# EAGLE design mb_01-1 (EAGLE 7.7.0)
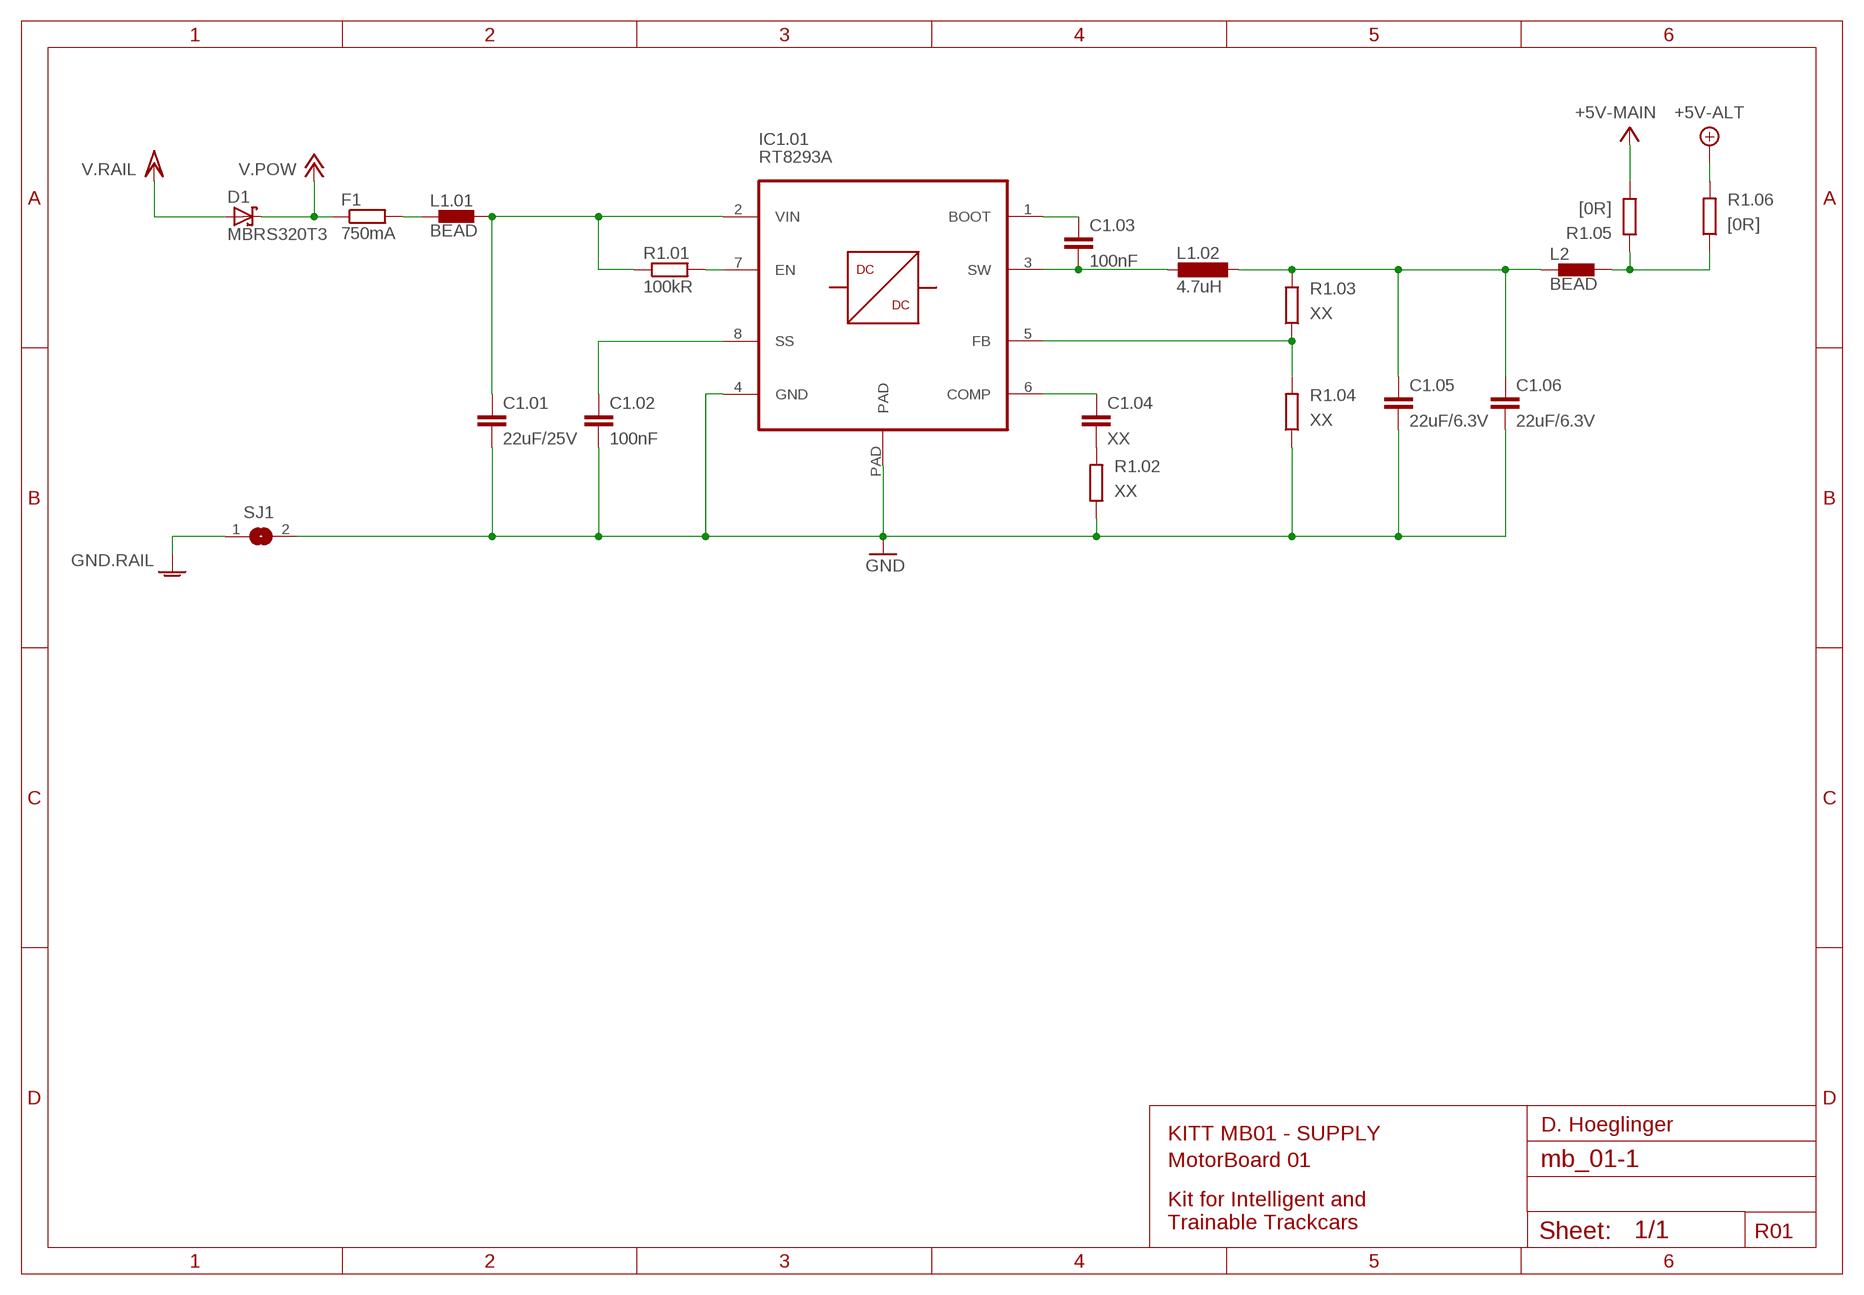
[diagram p0: schematic, sheet 1]

## Parts
C1.01  22uF/25V  C-EUC1210K  [C1210K]
C1.02  100nF  C-EUC0402K  [C0402K]
C1.03  100nF  C-EUC0402K  [C0402K]
C1.04  XX  C-EUC0402K  [C0402K]
C1.05  22uF/6.3V  C-EUC1206K  [C1206K]
C1.06  22uF/6.3V  C-EUC1206K  [C1206K]
D1  MBRS320T3  [SMC]
F1  750mA  R-EU_R0805  [R0805]
IC1.01  RT8293A  [SOIC-8-PAD]
L1.01  BEAD  BLM15HB121SN1  [0402]
L1.02  4.7uH  NRS8030XX  [TAIYO-YUDEN.NRS8030T4R7MJGJ]
L2  BEAD  BLM15HB121SN1  [0402]
R1.01  100kR  R-EU_R0402  [R0402]
R1.02  XX  R-EU_R0402  [R0402]
R1.03  XX  R-EU_R0402  [R0402]
R1.04  XX  R-EU_R0402  [R0402]
R1.05  [0R]  R-EU_R0402  [R0402]
R1.06  [0R]  R-EU_R0402  [R0402]
SJ1  SJ  [SJ]

## Nets
+5V: R1.05.1 R1.06.2 ; supply symbol labelled +5V-MAIN, +5V-ALT
+12V: D1.C F1.1 ; supply symbol labelled V.POW
GND: C1.01.2 C1.02.2 C1.05.2 C1.06.2 IC1.01.4(GND) IC1.01.PAD R1.02.1 R1.04.1 SJ1.2
GNDA: SJ1.1 ; supply symbol labelled GND.RAIL
N$2: F1.2 L1.01.1
N$3: C1.01.1 IC1.01.2(VIN) L1.01.2 R1.01.1
N$4: IC1.01.7(EN) R1.01.2
N$5: C1.02.1 IC1.01.8(SS)
N$7: C1.04.2 R1.02.2
N$25: C1.04.1 IC1.01.6(COMP)
N$28: IC1.01.5(FB) R1.03.1 R1.04.2
N$29: C1.05.1 C1.06.1 L1.02.1 L2.1 R1.03.2
N$30: C1.03.2 IC1.01.3(SW) L1.02.2
N$31: C1.03.1 IC1.01.1(BOOT)
N$32: L2.2 R1.05.2 R1.06.1
VCC/2: D1.A ; supply symbol labelled V.RAIL

## Notes on the sheet
- D. Hoeglinger
- KITT MB01 | - SUPPLY
- MotorBoard 01
- Kit for Intelligent and
  Trainable Trackcars
- R01

## Library data of the parts
C1.01-C1.06 = rcl:C-EU: CAPACITOR, European symbol
D1 = diode:MBRS3*0T3: SCHOTTKY BARRIER RECTIFIER 3.0 AMPERES 20, 30, 40 VOLT Source: MBRS340T3-D.pdf
F1 R1.01-R1.06 = rcl:R-EU_: RESISTOR, European symbol
IC1.01 = kitt.ic:RT8293A
L1.01 L2 = inductors:BLM15H: EMIFIL (R) Chip Ferrite Bead for GHz Noise Source: http://www.murata.com/ Ferrite Bead BLM15H.pdf
L1.02 = kitt.psvs:NRS8030XX
SJ1 = jumper:SJ: SMD solder JUMPER

## Board
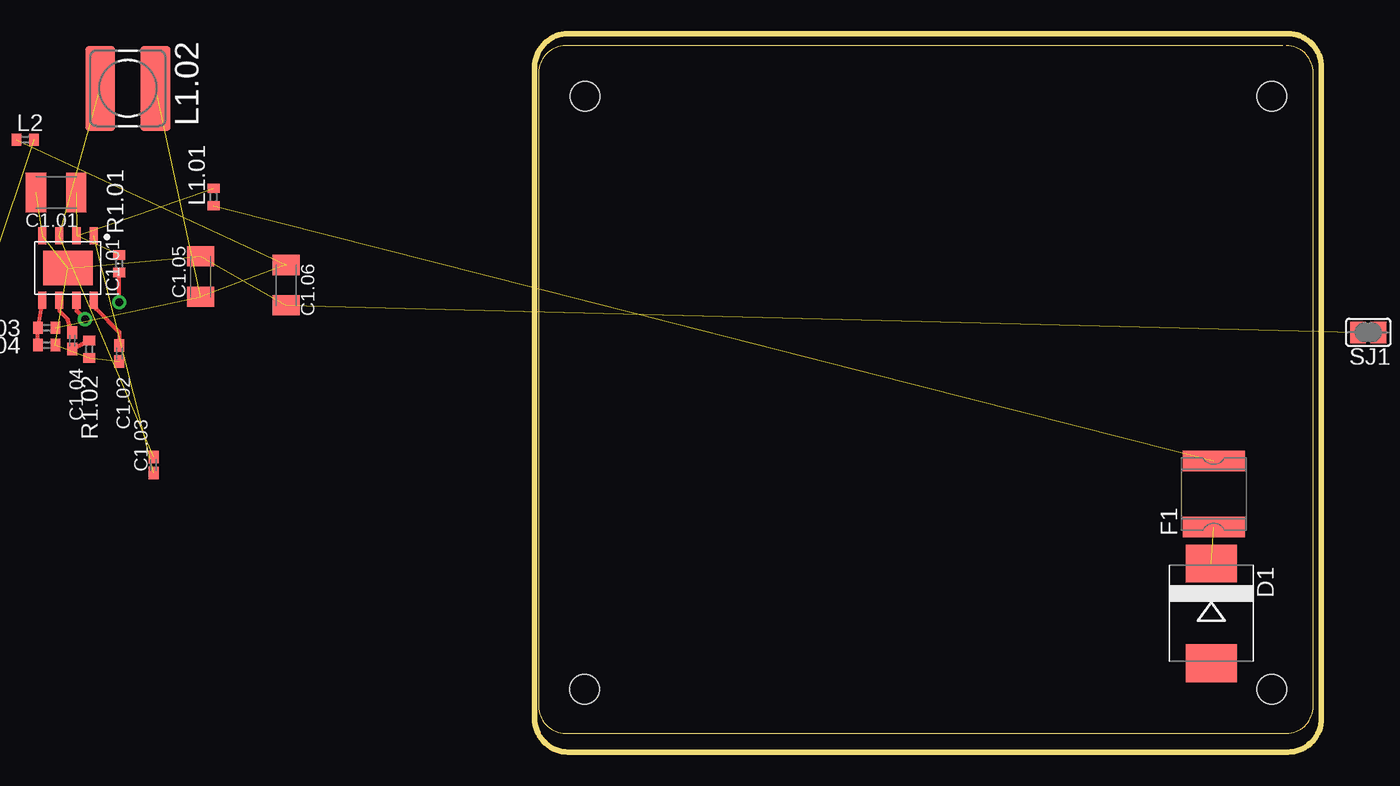
[diagram p1: board, top side]
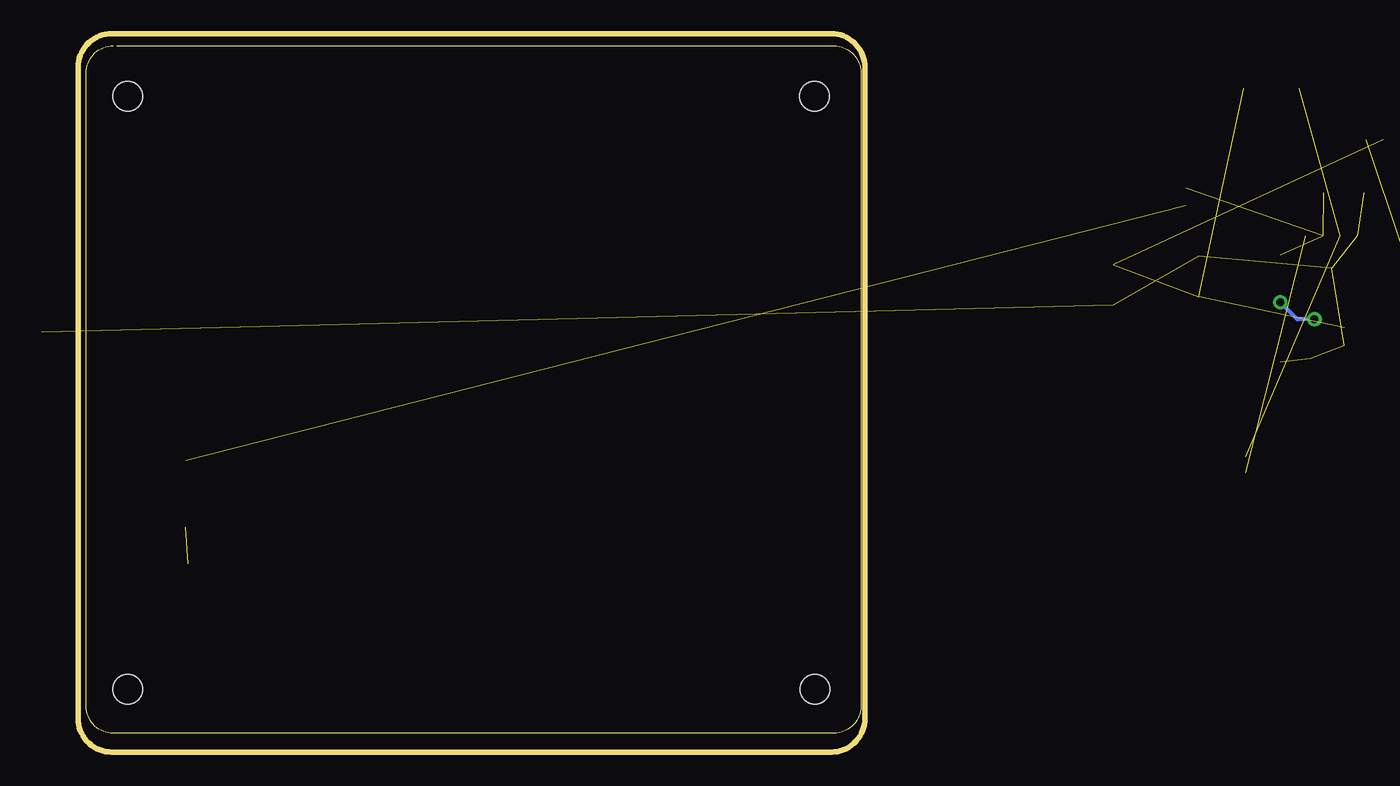
[diagram p2: board, bottom side, seen from below]

Size 58.4 x 53.3 mm. Coordinates in mm from the lower left corner, seen from the top.
Outline: 55.55,52.4 2.3,52.4 arc90 0.3,50.4 0.3,3.4 arc90 2.3,1.4 55.8,1.4 arc90 57.8,3.4 57.8,50.4 arc90 55.8,52.4
Outline: 2.5,53.3 arc90 0,50.8 0,2.5 arc90 2.5,0 55.9,0 arc90 58.4,2.5 58.4,50.8 arc90 55.9,53.3 2.4,53.3
Copper layers (1*2+3*4+5*6+7*16): Top 0.035mm / dielectric 0.2mm / Route2 0.035mm / dielectric 0.15mm / Route3 0.035mm / dielectric 0.2mm / layer 4 0.035mm / dielectric 0.15mm / layer 5 0.035mm / dielectric 0.2mm / layer 6 0.035mm / dielectric 0.15mm / layer 7 0.035mm / dielectric 0.2mm / Bottom 0.035mm
Design rules "default *": minimum track width 6mil, minimum drill 0.25mm, track to track 6mil, track to pad 8mil, pad to pad 8mil, via to via 6mil, smd to smd 8mil, copper to edge 12mil, drill to drill 24mil, minimum pad ring 9mil, minimum via ring 9mil, stop-mask expansion 3mil, vias tented up to drill 0mil, thermal gap 12mil
Holes 2.2 mm at 3.72,4.65 54.72,4.65 3.74,48.64 54.72,48.64
Milling: 4 lines

### Footprints (pad centres in the part's own frame; a part is rotated, then mirrored left to right if it is on the bottom)
C1210K = smd 1.5 x 2.9: 1 -1.5,0; 2 1.5,0
C0402K = smd 0.925 x 0.74: 1 -0.6,0; 2 0.6,0
C1206K = smd 1.5 x 2: 1 -1.5,0; 2 1.5,0
SMC = smd 2.8 x 3.8: A 3.7,0; C -3.7,0
MF-SMDF050 = smd 1.5 x 4.6: 1 -2.45,0; 2 2.45,0
SOIC-8-PAD = smd 1.27 x 0.6: 1 -2.4,1.905; 2 -2.4,0.635; 3 -2.4,-0.635; 4 -2.4,-1.905; 5 2.4,-1.905; 6 2.4,-0.635; 7 2.4,0.635; 8 2.4,1.905 | smd 2.55 x 3.7: PAD 0,0
0402 = smd 0.7 x 0.9: 1 -0.65,0; 2 0.65,0
POWER-CHOKE_WE-TPC = smd 6.3 x 2.2: 1 0,2.05; 2 0,-2.05
R0402 = smd 0.7 x 0.9: 1 -0.65,0; 2 0.65,0
SJ = smd 1.168 x 1.6: 1 -0.762,0; 2 0.762,0

### Placement (x,y rotation side)
C1.01  -35.51,41.52 180 top  (outside the outline)
C1.02  -30.82,29.57 270 top  (outside the outline)
C1.03  -28.28,21.31 90 top  (outside the outline)
C1.04  -34.32,30.52 270 top  (outside the outline)
C1.05  -24.79,35.28 90 top  (outside the outline)
C1.06  -18.44,34.64 270 top  (outside the outline)
D1  50.23,10.29 270 top
F1  750mA  [MF-SMDF050]  50.4,19.15 90 top
IC1.01  -34.63,35.91 270 top  (outside the outline)
L1.01  -23.82,41.19 90 top  (outside the outline)
L1.02  4.7uH  [POWER-CHOKE_WE-TPC]  -30.19,49.25 270 top  (outside the outline)
L2  -37.81,45.44 0 top  (outside the outline)
R1.01  -30.82,36.23 270 top  (outside the outline)
R1.02  -33.05,29.88 90 top  (outside the outline)
R1.03  -36.22,31.47 0 top  (outside the outline)
R1.04  -36.22,30.2 180 top  (outside the outline)
R1.05  -101.31,-144.11 0 top  (outside the outline)
R1.06  -101.31,-149.19 0 top  (outside the outline)
SJ1  61.87,31.14 180 top
U$1  [REF_GCB2_BS]  -158.78,7.02 0 top  (outside the outline)
U$2  [REF_GCB2_TS]  -57.81,3.69 0 top  (outside the outline)

### Tracks (layer width: path | path; a pad name or v marks a point on that pad's centre or on a via)
+5V  (1 unrouted)
+12V  (1 unrouted)
GND  (8 unrouted)
N$2  (1 unrouted)
N$3  (3 unrouted)
N$4  (via drill 0.6)
  Top 0.305: IC1.01.7 -34,32.74 v-33.36,32.11 | v-30.82,33.37 R1.01.2
  Bottom 0.305: v-33.36,32.11 -32.09,32.11 v-30.82,33.37
N$5
  Top 0.305: IC1.01.8 -32.55,32.88 -30.82,31.15 C1.02.1
N$7
  Top 0.305: C1.04.2 R1.02.2
N$25
  Top 0.305: C1.04.1 -34.63,32.11 -35.27,32.74 IC1.01.6
N$28
  Top 0.305: R1.04.2 R1.03.1 -36.55,33.5 IC1.01.5
  Top 0.406: IC1.01.5 -36.55,33.51
N$29  (4 unrouted)
N$30  (2 unrouted)
N$31  (1 unrouted)
N$32  (2 unrouted)

### Text on the board
Milling: EAGLE EDU LIMIT
Reference: <-- Rail Power Leads | Motor Leads -->